# EAGLE design MCB-ODIN-W2-v2.0.0 (EAGLE 7.7.0)

## Sheet 1 of 2
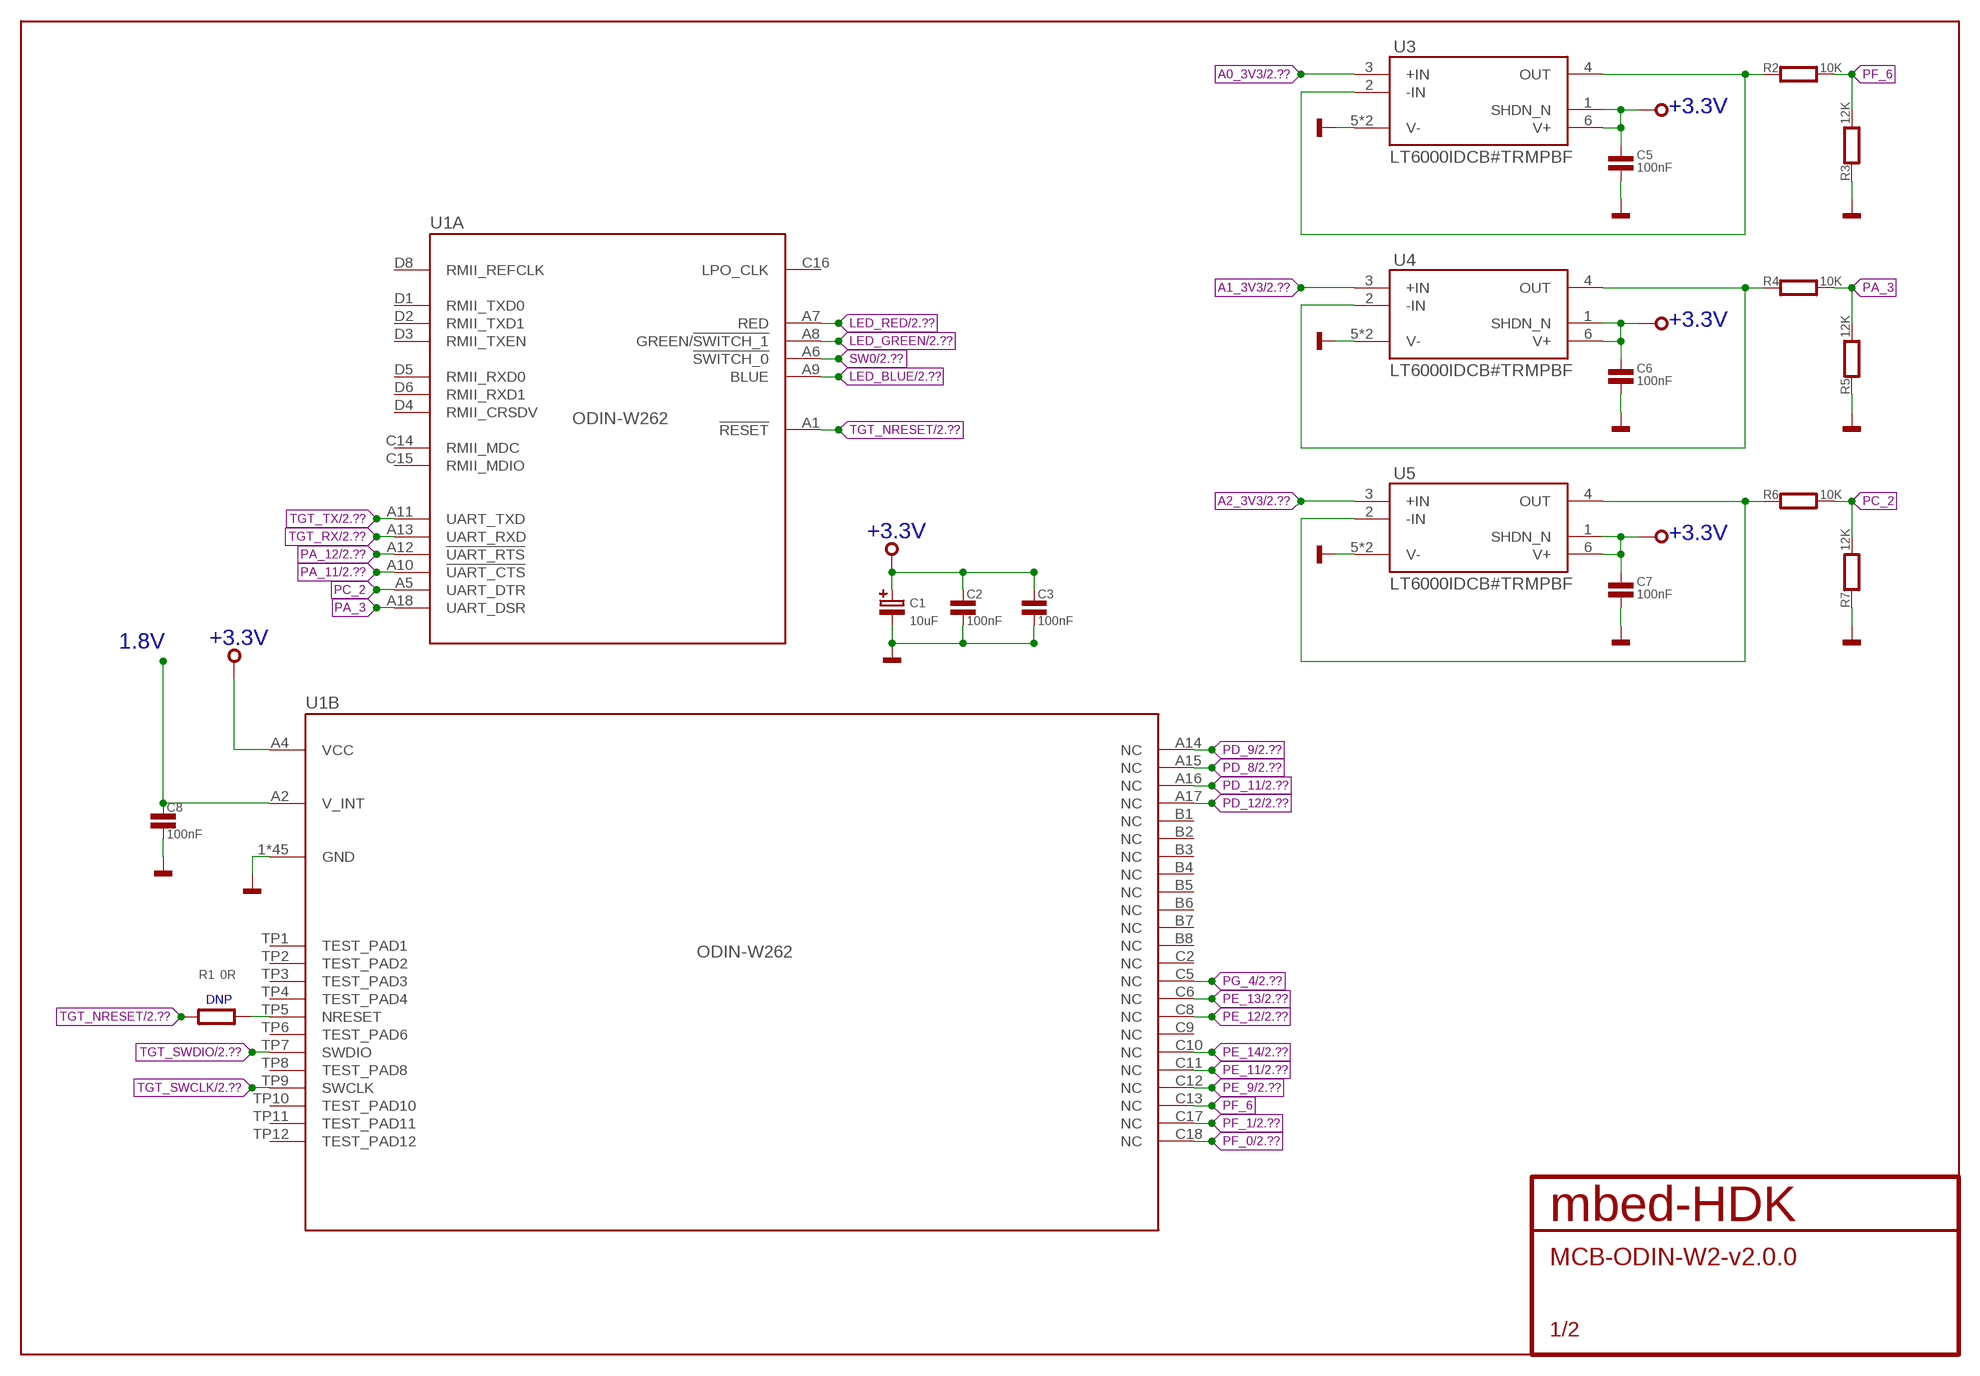
[diagram p0: schematic, sheet 1]

### Parts
C1  10uF  C-POLB  [SMC_B]
C2  100nF  C0603  [0603]
C3  100nF  C0603  [0603]
C5  100nF  C0603  [0603]
C6  100nF  C0603  [0603]
C7  100nF  C0603  [0603]
C8  100nF  C0603  [0603]
R1  0R  R0603  [0603]
R2  10K  R0603  [0603]
R3  12K  R0603  [0603]
R4  10K  R0603  [0603]
R5  12K  R0603  [0603]
R6  10K  R0603  [0603]
R7  12K  R0603  [0603]
U1  ODIN-W262  [ODIN-88]
U3  LT6000IDCB#TRMPBF  [6-DFN]
U4  LT6000IDCB#TRMPBF  [6-DFN]
U5  LT6000IDCB#TRMPBF  [6-DFN]

### Nets
1.8V: C8.1 U1.A2(B:V_INT) ; also sheet 2
+3.3V: C1.+ C2.1 C3.1 C5.1 C6.1 C7.1 U1.A4(B:VCC) U3.1(SHDN_N) U3.6(V+) U4.1(SHDN_N) U4.6(V+) U5.1(SHDN_N) U5.6(V+) ; also sheet 2
A0_3V3: U3.3(+IN) ; also sheet 2
A1_3V3: U4.3(+IN) ; also sheet 2
A2_3V3: U5.3(+IN) ; also sheet 2
GND: C1.- C2.2 C3.2 C5.2 C6.2 C7.2 C8.2 R3.1 R5.1 R7.1 U1.1(B:GND) U1.2(B:GND) U1.3(B:GND) U1.4(B:GND) U1.5(B:GND) U1.6(B:GND) U1.7(B:GND) U1.8(B:GND) U1.9(B:GND) U1.10(B:GND) U1.11(B:GND) U1.12(B:GND) U1.13(B:GND) U1.14(B:GND) U1.15(B:GND) U1.16(B:GND) U1.17(B:GND) U1.18(B:GND) U1.19(B:GND) U1.20(B:GND) U1.21(B:GND) U1.22(B:GND) U1.23(B:GND) U1.24(B:GND) U1.25(B:GND) U1.26(B:GND) U1.27(B:GND) U1.28(B:GND) U1.29(B:GND) U1.30(B:GND) U1.31(B:GND) U1.32(B:GND) U1.33(B:GND) U1.34(B:GND) U1.35(B:GND) U1.36(B:GND) U1.37(B:GND) U1.38(B:GND) U1.39(B:GND) U1.A3(B:GND) U1.C1(B:GND) U1.C3(B:GND) U1.C4(B:GND) U1.C7(B:GND) U1.D7(B:GND) U3.5(V-) U3.P$7(V-) U4.5(V-) U4.P$7(V-) U5.5(V-) U5.P$7(V-) ; also sheet 2
LED_BLUE: U1.A9(A:BLUE) ; also sheet 2
LED_GREEN: U1.A8(A:GREEN/!SWITCH_1) ; also sheet 2
LED_RED: U1.A7(A:RED) ; also sheet 2
N$1: R1.2 U1.TP5(B:NRESET)
N$2: R2.1 U3.2(-IN) U3.4(OUT)
N$3: R4.1 U4.2(-IN) U4.4(OUT)
N$4: R6.1 U5.2(-IN) U5.4(OUT)
PA_3: R4.2 R5.2 U1.A18(A:UART_DSR)
PA_11: U1.A10(A:!UART_CTS) ; also sheet 2
PA_12: U1.A12(A:!UART_RTS) ; also sheet 2
PC_2: R6.2 R7.2 U1.A5(A:UART_DTR)
PD_8: U1.A15(B:NC) ; also sheet 2
PD_9: U1.A14(B:NC) ; also sheet 2
PD_11: U1.A16(B:NC) ; also sheet 2
PD_12: U1.A17(B:NC) ; also sheet 2
PE_9: U1.C12(B:NC) ; also sheet 2
PE_11: U1.C11(B:NC) ; also sheet 2
PE_12: U1.C8(B:NC) ; also sheet 2
PE_13: U1.C6(B:NC) ; also sheet 2
PE_14: U1.C10(B:NC) ; also sheet 2
PF_0: U1.C18(B:NC) ; also sheet 2
PF_1: U1.C17(B:NC) ; also sheet 2
PF_6: R2.2 R3.2 U1.C13(B:NC)
PG_4: U1.C5(B:NC) ; also sheet 2
SW0: U1.A6(A:!SWITCH_0) ; also sheet 2
TGT_NRESET: R1.1 U1.A1(A:!RESET) ; also sheet 2
TGT_RX: U1.A13(A:UART_RXD) ; also sheet 2
TGT_SWCLK: U1.TP9(B:SWCLK) ; also sheet 2
TGT_SWDIO: U1.TP7(B:SWDIO) ; also sheet 2
TGT_TX: U1.A11(A:UART_TXD) ; also sheet 2
Unconnected: U1.B1(B:NC) U1.B2(B:NC) U1.B3(B:NC) U1.B4(B:NC) U1.B5(B:NC) U1.B6(B:NC) U1.B7(B:NC) U1.B8(B:NC) U1.C2(B:NC) U1.C9(B:NC) U1.C14(A:RMII_MDC) U1.C15(A:RMII_MDIO) U1.C16(A:LPO_CLK) U1.D1(A:RMII_TXD0) U1.D2(A:RMII_TXD1) U1.D3(A:RMII_TXEN) U1.D4(A:RMII_CRSDV) U1.D5(A:RMII_RXD0) U1.D6(A:RMII_RXD1) U1.D8(A:RMII_REFCLK) U1.TP1(B:TEST_PAD1) U1.TP2(B:TEST_PAD2) U1.TP3(B:TEST_PAD3) U1.TP4(B:TEST_PAD4) U1.TP6(B:TEST_PAD6) U1.TP8(B:TEST_PAD8) U1.TP10(B:TEST_PAD10) U1.TP11(B:TEST_PAD11) U1.TP12(B:TEST_PAD12)

### Notes on the sheet
- DNP

## Sheet 2 of 2
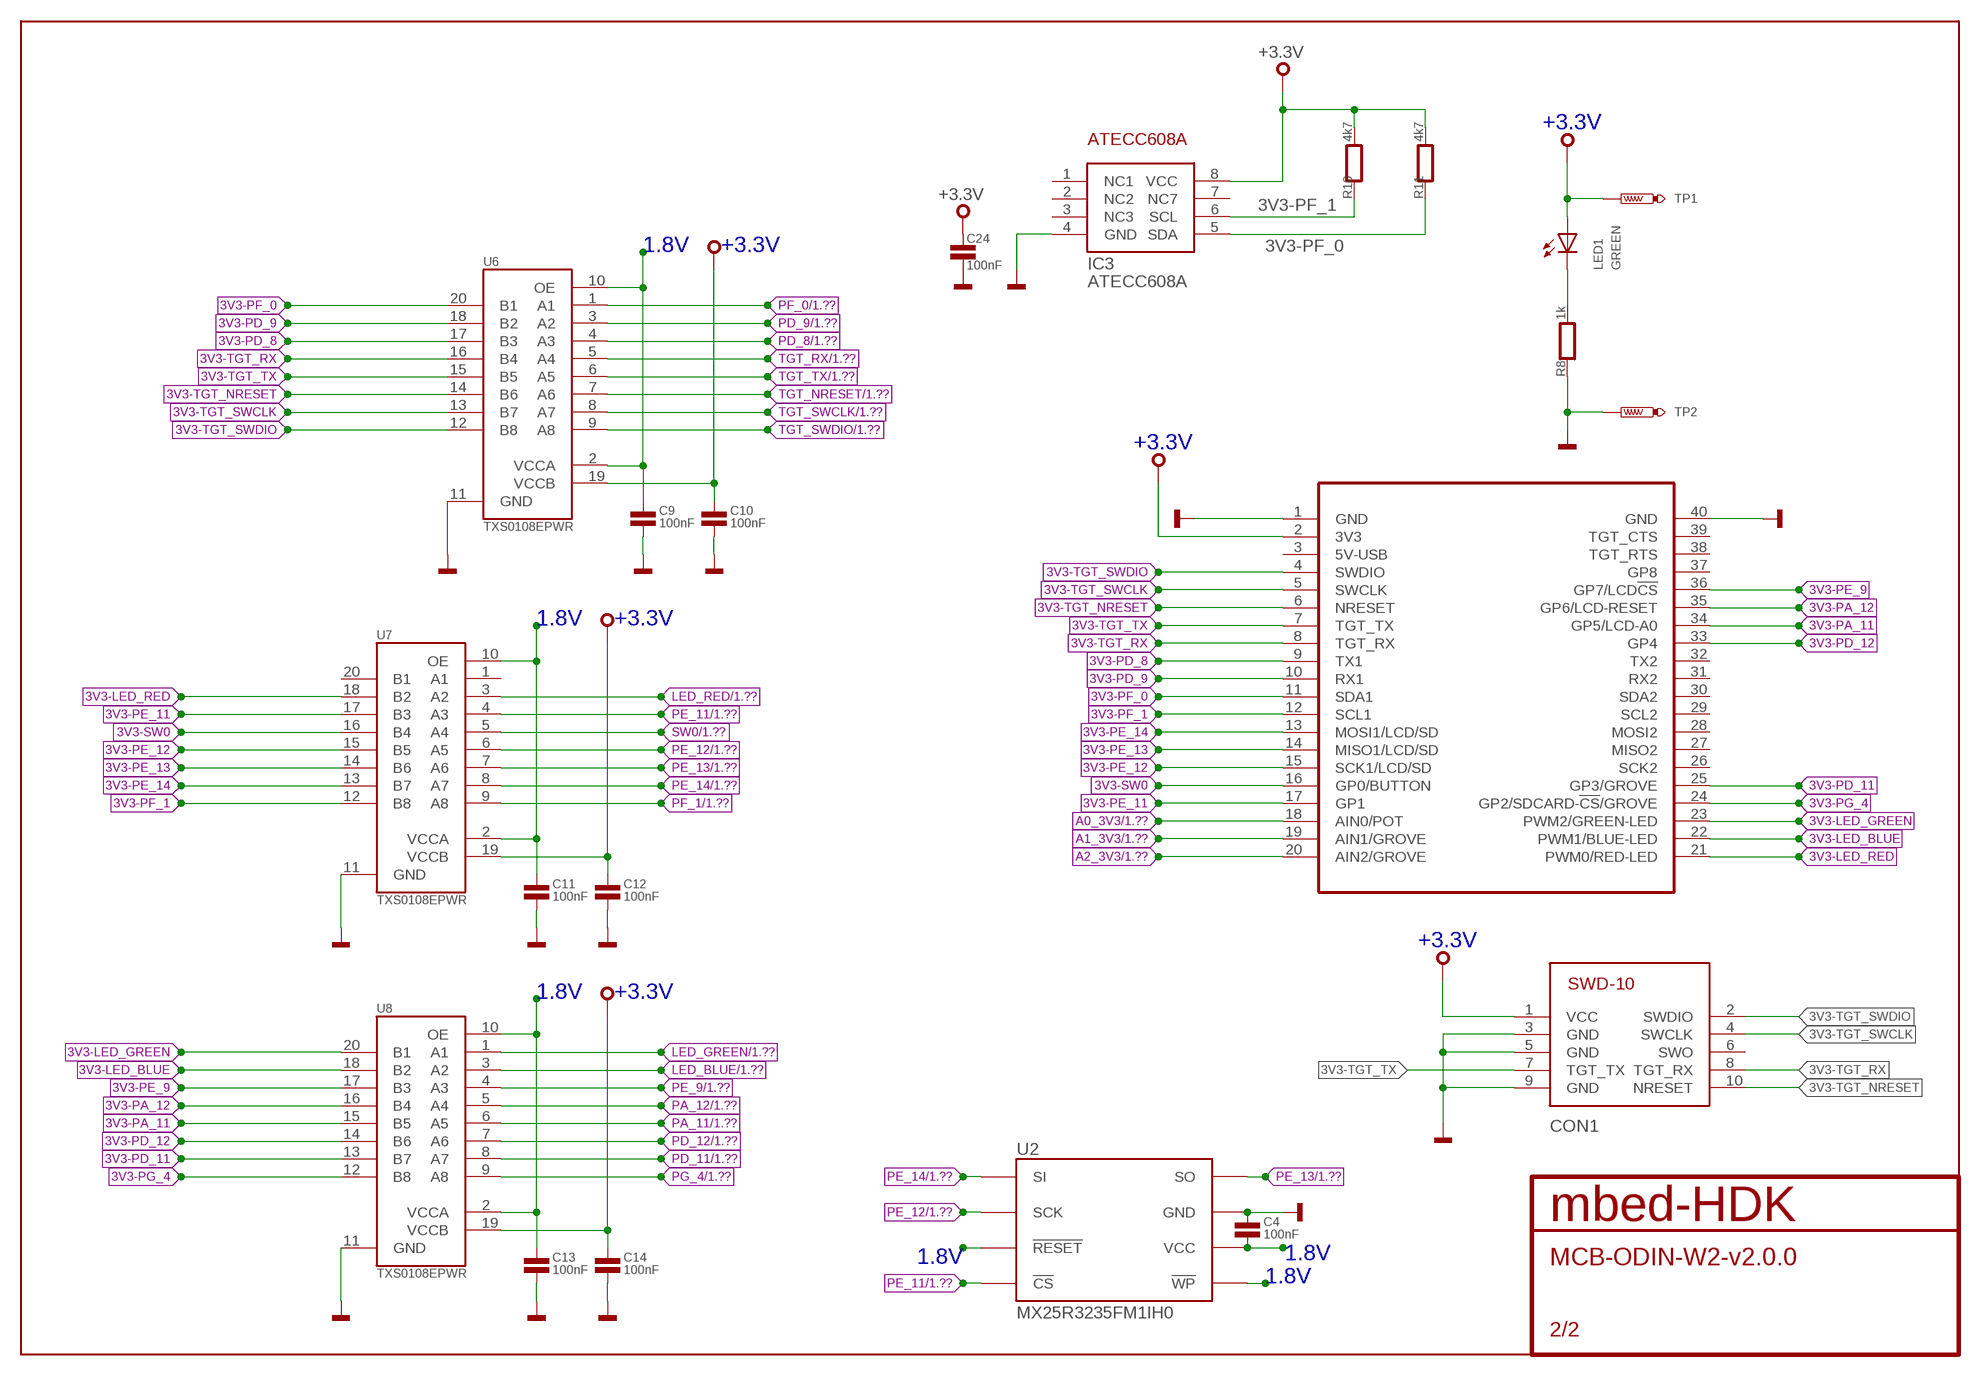
[diagram p1: schematic, sheet 2]

### Parts
C4  100nF  C0603  [0603]
C9  100nF  C0603  [0603]
C10  100nF  C0603  [0603]
C11  100nF  C0603  [0603]
C12  100nF  C0603  [0603]
C13  100nF  C0603  [0603]
C14  100nF  C0603  [0603]
C24  100nF  C0603  [0603]
CON1  SWD-10/TC2050_SMD  [FTSH-105-02]
IC3  ATECC608A  [SO8]
LED1  GREEN  SMD_LED0603  [CHIPLED_0603]
MOD1  MODULE_DAUGHTER  [MODULE_DAUGHTER]
R8  1k  R0603  [0603]
R10  4k7  R0603  [0603]
R11  4k7  R0603  [0603]
TP1  TEST_POINT-50R-PTH  [TP50-PTH]
TP2  TEST_POINT-50R-PTH  [TP50-PTH]
U2  MX25R3235FM1IH0  [SO8]
U6  TXS0108EPWR  [TSSOP-20]
U7  TXS0108EPWR  [TSSOP-20]
U8  TXS0108EPWR  [TSSOP-20]

### Nets
1.8V: C4.2 C9.1 C11.1 C13.1 U2.3(!WP) U2.7(!RESET) U2.8(VCC) U6.2(VCCA) U6.10(OE) U7.2(VCCA) U7.10(OE) U8.2(VCCA) U8.10(OE) ; also sheet 1
3V3-LED_BLUE: MOD1.22(PWM1/BLUE-LED) U8.18(B2)
3V3-LED_GREEN: MOD1.23(PWM2/GREEN-LED) U8.20(B1)
3V3-LED_RED: MOD1.21(PWM0/RED-LED) U7.18(B2)
3V3-PA_11: MOD1.34(GP5/LCD-A0) U8.15(B5)
3V3-PA_12: MOD1.35(GP6/LCD-RESET) U8.16(B4)
3V3-PD_8: MOD1.9(TX1) U6.17(B3)
3V3-PD_9: MOD1.10(RX1) U6.18(B2)
3V3-PD_11: MOD1.25(GP3/GROVE) U8.13(B7)
3V3-PD_12: MOD1.33(GP4) U8.14(B6)
3V3-PE_9: MOD1.36(GP7/LCD!CS) U8.17(B3)
3V3-PE_11: MOD1.17(GP1) U7.17(B3)
3V3-PE_12: MOD1.15(SCK1/LCD/SD) U7.15(B5)
3V3-PE_13: MOD1.14(MISO1/LCD/SD) U7.14(B6)
3V3-PE_14: MOD1.13(MOSI1/LCD/SD) U7.13(B7)
3V3-PF_0: IC3.5(SDA) MOD1.11(SDA1) R11.1 U6.20(B1)
3V3-PF_1: IC3.6(SCL) MOD1.12(SCL1) R10.1 U7.12(B8)
3V3-PG_4: MOD1.24(GP2/SDCARD-!CS!/GROVE) U8.12(B8)
3V3-SW0: MOD1.16(GP0/BUTTON) U7.16(B4)
3V3-TGT_NRESET: CON1.10(NRESET) MOD1.6(NRESET) U6.14(B6)
3V3-TGT_RX: CON1.8(TGT_RX) MOD1.8(TGT_RX) U6.16(B4)
3V3-TGT_SWCLK: CON1.4(SWCLK) MOD1.5(SWCLK) U6.13(B7)
3V3-TGT_SWDIO: CON1.2(SWDIO) MOD1.4(SWDIO) U6.12(B8)
3V3-TGT_TX: CON1.7(TGT_TX) MOD1.7(TGT_TX) U6.15(B5)
+3.3V: C10.1 C12.1 C14.1 C24.1 CON1.1(VCC) IC3.8(VCC) LED1.A MOD1.2(3V3) R10.2 R11.2 TP1.TP U6.19(VCCB) U7.19(VCCB) U8.19(VCCB) ; also sheet 1
A0_3V3: MOD1.18(AIN0/POT) ; also sheet 1
A1_3V3: MOD1.19(AIN1/GROVE) ; also sheet 1
A2_3V3: MOD1.20(AIN2/GROVE) ; also sheet 1
GND: C4.1 C9.2 C10.2 C11.2 C12.2 C13.2 C14.2 C24.2 CON1.3(GND) CON1.5(GND) CON1.9(GND) IC3.4(GND) MOD1.1(GND) MOD1.40(GND) R8.1 TP2.TP U2.4(GND) U6.11(GND) U7.11(GND) U8.11(GND) ; also sheet 1
LED_BLUE: U8.3(A2) ; also sheet 1
LED_GREEN: U8.1(A1) ; also sheet 1
LED_RED: U7.3(A2) ; also sheet 1
PA_1: LED1.C R8.2
PA_11: U8.6(A5) ; also sheet 1
PA_12: U8.5(A4) ; also sheet 1
PD_8: U6.4(A3) ; also sheet 1
PD_9: U6.3(A2) ; also sheet 1
PD_11: U8.8(A7) ; also sheet 1
PD_12: U8.7(A6) ; also sheet 1
PE_9: U8.4(A3) ; also sheet 1
PE_11: U2.1(!CS) U7.4(A3) ; also sheet 1
PE_12: U2.6(SCK) U7.6(A5) ; also sheet 1
PE_13: U2.2(SO) U7.7(A6) ; also sheet 1
PE_14: U2.5(SI) U7.8(A7) ; also sheet 1
PF_0: U6.1(A1) ; also sheet 1
PF_1: U7.9(A8) ; also sheet 1
PG_4: U8.9(A8) ; also sheet 1
SW0: U7.5(A4) ; also sheet 1
TGT_NRESET: U6.7(A6) ; also sheet 1
TGT_RX: U6.5(A4) ; also sheet 1
TGT_SWCLK: U6.8(A7) ; also sheet 1
TGT_SWDIO: U6.9(A8) ; also sheet 1
TGT_TX: U6.6(A5) ; also sheet 1
Unconnected: CON1.6(SWO) IC3.1(NC1) IC3.2(NC2) IC3.3(NC3) IC3.7(NC7) MOD1.3(5V-USB) MOD1.26(SCK2) MOD1.27(MISO2) MOD1.28(MOSI2) MOD1.29(SCL2) MOD1.30(SDA2) MOD1.31(RX2) MOD1.32(TX2) MOD1.37(GP8) MOD1.38(TGT_RTS) MOD1.39(TGT_CTS) U7.1(A1) U7.20(B1)

## Library data of the parts
C1 = mbed-HDK-RLC:C-POL: Polarised capacitor; MF: Kemet; MFN: T491B106K020AT; OC-DIGIKEY: 399-8298-1-ND; OC-MOUSER: 80-T491B106K020; OC-NEWARK: 57K1740
C2-C14 C24 = mbed-HDK-RLC:C: Capacitor
CON1 = mbed-HDK-Connector:SWD-10/TC2050: 1mm pitch 10-Pin Cortex Programming Header with optional TC2050 footprint solderless interchangeable
IC3 = mbed-HDK-MF-ATMEL:ATECC608A: I2C Secure element and crytpo accelerator; MF: Atmel; MFN: ATECC608A; OC-DIGIKEY: ATECC608A-SSHDA-TCT-ND; OC-MOUSER: 556-ATECC608ASSHDAB
LED1 = mbed-HDK-Optical:SMD_LED: LED SMD, Colour Red; MF: Wurth Electronics Inc; MFN: 150060RS75000; OC-DIGIKEY: 732-4978-1-ND; OC-MOUSER: 710-150060RS75000; OC-NEWARK: 2322071
MOD1 = mbed-HDK-misc-Board:MODULE_DAUGHTER
R1-R8 R10 R11 = mbed-HDK-RLC:R: Resistor
TP1 TP2 = mbed-HDK-Connector:TEST_POINT
U1 = mbed-HDK-MF-UBLOX:ODIN-W262: ODIN-W260: Host-based multiradio module with Wi-Fi and Bluetooth, internal antenna u-blox.com
U2 = mbed-HDK-IC:MX25R3235FM1IH0: Serial Flash 32 Mb 80 Mhz; MF: Macronix; MFN: MX25R3235FM2IH0; OC-DIGIKEY: 1092-1174-ND
U3-U5 = mbed-HDK-IC:LT6000IDCB#TRMPBF: IC OPAMP GBP 60KHZ RRO 6DFN; MF: Linear Technology; MFN: LT6000IDCB#TRMPBF; OC-DIGIKEY: LT6000IDCB#TRMPBFCT-ND; OC-NEWARK: 95M6567
U6-U8 = mbed-HDK-IC:TXS0108EPWR: 8-Bit Bi-directional, Level-Shifting, Voltage Translator; MF: Texas Instruments; MFN: TXS0108EPWR; OC-DIGIKEY: 296-23011-1-ND; OC-MOUSER: 595-TXS0108EPWR; OC-NEWARK: 05R8300

## Board
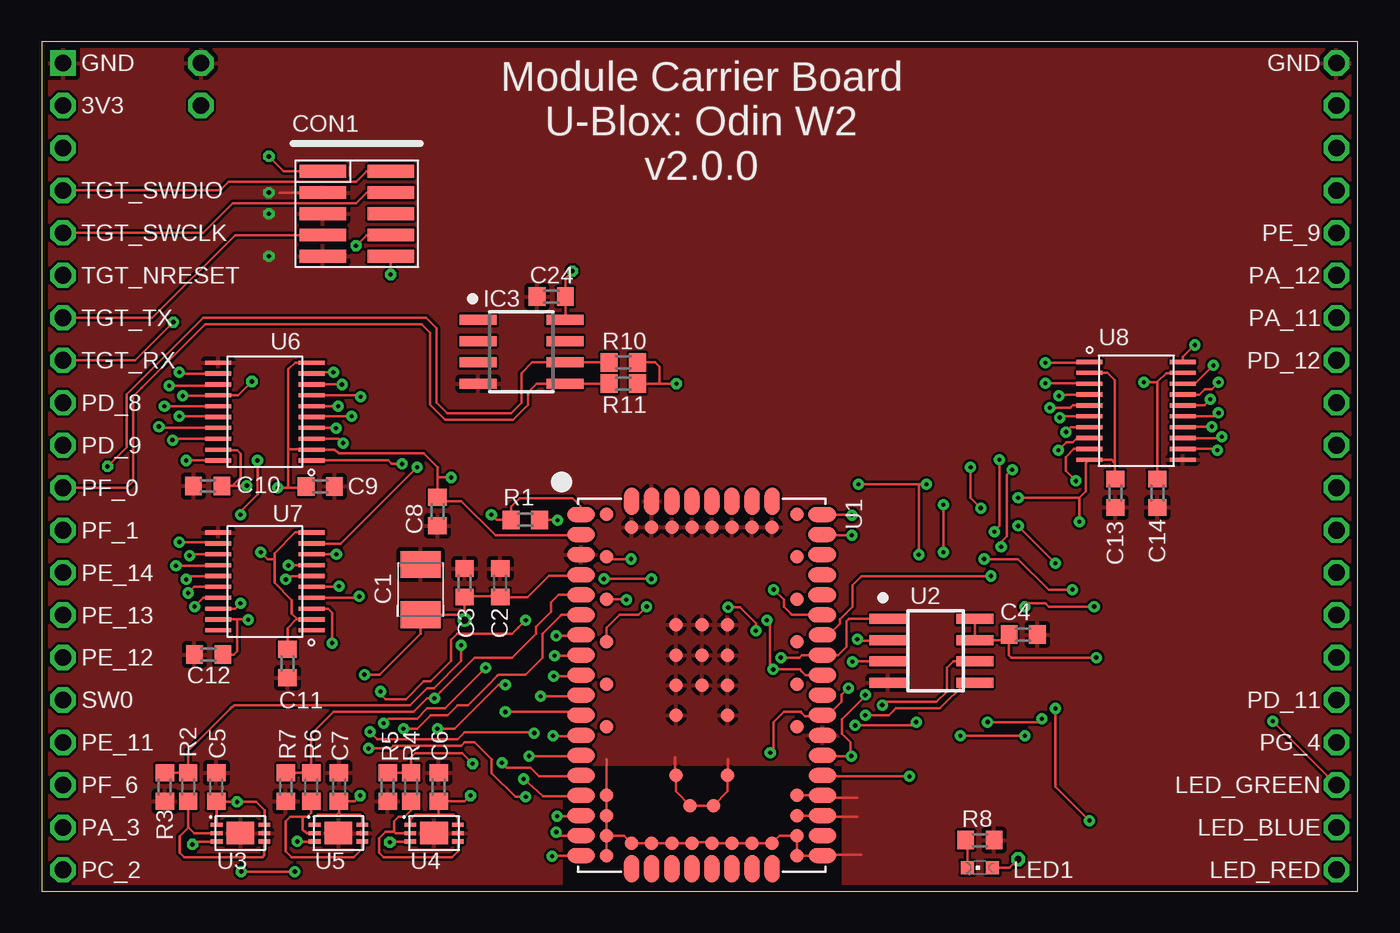
[diagram p2: board, top side]
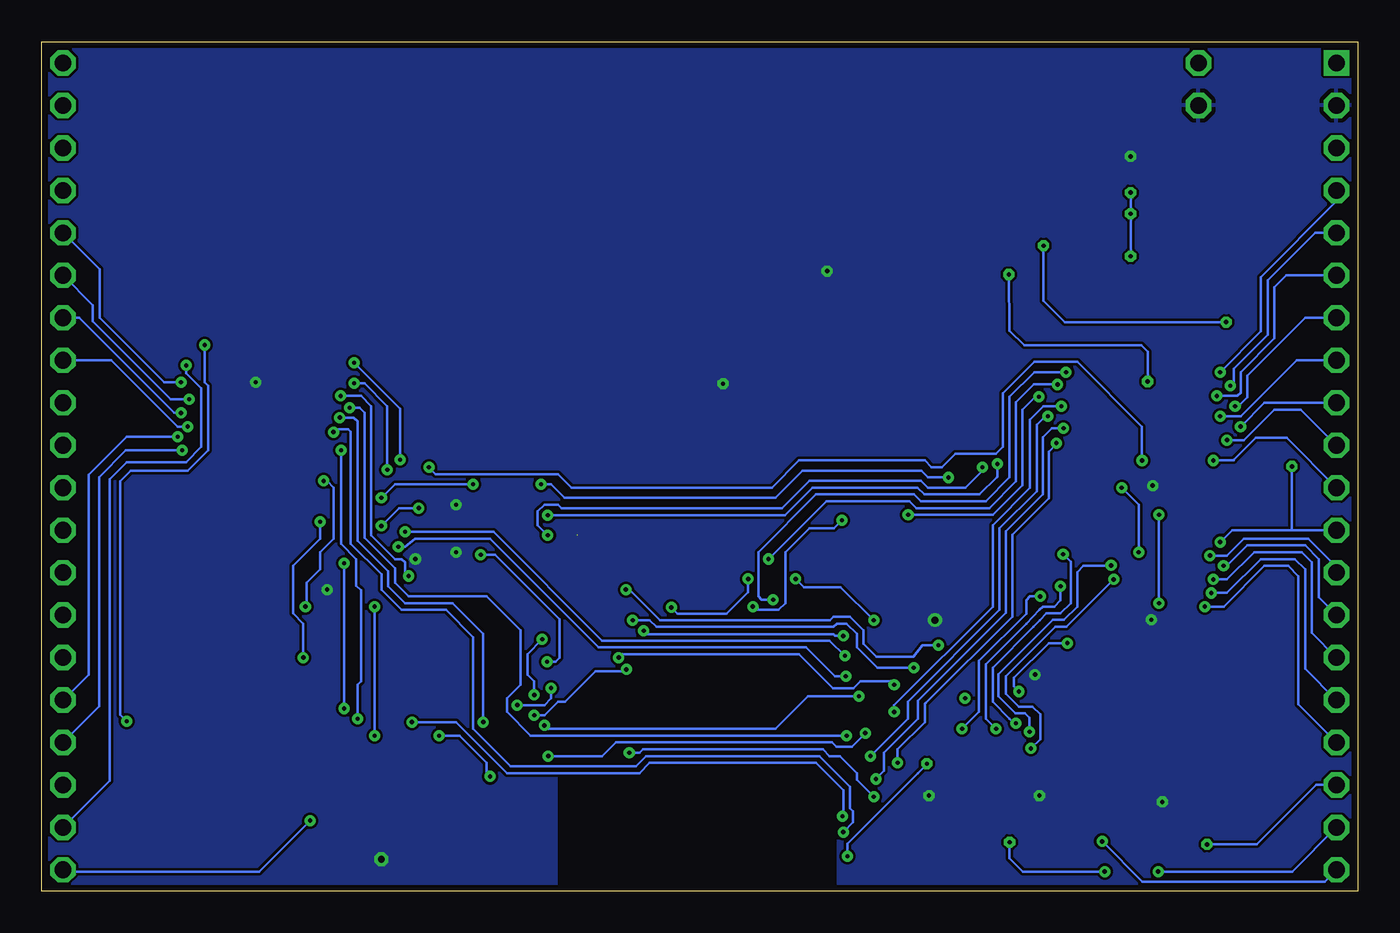
[diagram p3: board, bottom side, seen from below]

Size 78.74 x 50.8 mm. Coordinates in mm from the lower left corner, seen from the top.
Copper layers ((1*16)): Top 0.035mm / dielectric 0.8mm / Bottom 0.035mm
Design rules "mbed-HDK-6-6-2-layer": minimum track width 6mil, minimum drill 9mil, track to track 6mil, track to pad 6mil, pad to pad 6mil, via to via 6mil, smd to smd 6mil, copper to edge 15mil, drill to drill 8mil, minimum pad ring 10mil, minimum via ring 8mil, stop-mask expansion 4mil, vias tented up to drill 0mil, thermal gap 10mil
tRestrict: area 31.2,0.2 to 47.9,7.5
bRestrict: area 31.2,0.2 to 47.9,7.5

### Footprints (pad centres in the part's own frame; a part is rotated, then mirrored left to right if it is on the bottom)
SMC_B = smd 1.6 x 2.4: + -1.5,0; - 1.5,0
0603 = smd 1 x 1.1: 1 -0.85,0; 2 0.85,0
FTSH-105-02 = smd 0.762 x 2.794: 1 0.381,-2.032; 2 0.381,2.032; 3 1.651,-2.032; 4 1.651,2.032; 5 2.921,-2.032; 6 2.921,2.032; 7 4.191,-2.032; 8 4.191,2.032; 9 5.461,-2.032; 10 5.461,2.032
SO8 = smd 0.6 x 2.2: 1 -1.905,-2.6; 2 -0.635,-2.6; 3 0.635,-2.6; 4 1.905,-2.6; 5 1.905,2.6; 6 0.635,2.6; 7 -0.635,2.6; 8 -1.905,2.6
CHIPLED_0603 = smd 0.8 x 0.8: A 0,-0.75; C 0,0.75
MODULE_DAUGHTER = drill 1 square: 1 0,0 | drill 1 octagon: 2 0,-2.54; 3 0,-5.08; 4 0,-7.62; 5 0,-10.16; 6 0,-12.7; 7 0,-15.24; 8 0,-17.78; 9 0,-20.32; 10 0,-22.86; 11 0,-25.4; 12 0,-27.94; 13 0,-30.48; 14 0,-33.02; 15 0,-35.56; 16 0,-38.1; 17 0,-40.64; 18 0,-43.18; 19 0,-45.72; 20 0,-48.26; 21 76.2,-48.26; 22 76.2,-45.72; 23 76.2,-43.18; 24 76.2,-40.64; 25 76.2,-38.1; 26 76.2,-35.56; 27 76.2,-33.02; 28 76.2,-30.48; 29 76.2,-27.94; 30 76.2,-25.4; 31 76.2,-22.86; 32 76.2,-20.32; 33 76.2,-17.78; 34 76.2,-15.24; 35 76.2,-12.7; 36 76.2,-10.16; 37 76.2,-7.62; 38 76.2,-5.08; 39 76.2,-2.54; 40 76.2,0
TP50-PTH = drill 1 octagon: TP 0,0
ODIN-88 = smd 0.8 x 0.8: 1 6.6,-5.7; 2 7.8,-5.7; 3 9,-5.7; 4 10.2,-5.7; 5 9.45,-4.2; 6 9.45,-3; 7 9.45,-1.8; 8 9.45,-0.6; 9 9.45,0.6; 10 9.45,1.8; 11 9.45,3; 12 9.45,4.2; 13 10.2,5.7; 14 9,5.7; 15 7.8,5.7; 16 6.6,5.7; 17 -9.45,4.2; 18 -9.45,3; 19 -9.45,1.8; 20 -9.45,0.6; 21 -9.45,-0.6; 22 -9.45,-1.8; 23 -9.45,-3; 24 -9.45,-4.2; 25 -3.6,-1.54; 26 -1.8,-1.54; 27 0,-1.54; 28 1.8,-1.54; 29 5.4,-1.54; 30 7.2,-0.7; 31 -3.6,0; 32 -1.8,0; 33 0,0; 34 -3.6,1.54; 35 -1.8,1.54; 36 0,1.54; 37 1.8,1.54; 38 5.4,1.54; 39 7.2,0.7; TP1 2.49,-5.7; TP2 2.49,5.7; TP3 -0.05,-5.7; TP4 -0.05,5.7; TP5 -2.59,-5.7; TP6 -2.59,5.7; TP7 -5.13,-5.7; TP8 -5.13,5.7; TP9 -7.67,-5.7; TP10 -7.67,5.7; TP11 -10.21,-5.7; TP12 -10.21,5.7 | smd 0.9 x 1.651: A1 -10.196,-7.225; A2 -9.002,-7.225; A3 -7.809,-7.225; A4 -6.589,-7.225; A5 -5.396,-7.225; A6 -4.202,-7.225; A7 -3,-7.225; A8 -1.8,-7.225; A9 -0.6,-7.225; A10 0.6,-7.225; A11 1.8,-7.225; A12 3,-7.225; A13 4.2,-7.225; A14 5.4,-7.225; A15 6.6,-7.225; A16 7.8,-7.225; A17 9.006,-7.225; A18 10.2,-7.225; C1 10.2,7.225; C2 9,7.225; C3 7.8,7.225; C4 6.6,7.225; C5 5.4,7.225; C6 4.2,7.225; C7 3,7.225; C8 1.8,7.225; C9 0.6,7.225; C10 -0.6,7.225; C11 -1.8,7.225; C12 -3,7.225; C13 -4.2,7.2; C14 -5.4,7.2; C15 -6.6,7.2; C16 -7.8,7.2; C17 -9,7.2; C18 -10.2,7.2 | smd 1.651 x 0.9: B1 10.984,-4.202; B2 10.984,-3; B3 10.984,-1.8; B4 10.984,-0.6; B5 10.984,0.6; B6 10.984,1.794; B7 10.984,3; B8 10.984,4.2; D1 -10.987,4.2; D2 -10.987,3; D3 -10.987,1.8; D4 -10.987,0.6; D5 -10.987,-0.6; D6 -10.987,-1.8; D7 -10.987,-3; D8 -10.987,-4.2
6-DFN = smd 0.7 x 0.25: 1 0,0; 2 0,-0.5; 3 0,-1; 4 2.85,-1; 5 2.85,-0.5; 6 2.85,0 | smd 1.65 x 1.35: P$7 1.425,-0.5
TSSOP-20 = smd 1.55 x 0.25: 1 0,0; 2 0,-0.65; 3 0,-1.3; 4 0,-1.95; 5 0,-2.6; 6 0,-3.25; 7 0,-3.9; 8 0,-4.55; 9 0,-5.2; 10 0,-5.85; 11 5.6,-5.85; 12 5.6,-5.2; 13 5.6,-4.55; 14 5.6,-3.9; 15 5.6,-3.25; 16 5.6,-2.6; 17 5.6,-1.95; 18 5.6,-1.3; 19 5.6,-0.65; 20 5.6,0

### Placement (x,y rotation side)
C1  22.66,18.03 90 top
C2  27.43,18.44 90 top
C3  25.3,18.44 90 top
C4  58.72,15.34 180 top
C5  10.44,6.22 90 top
C6  23.75,6.22 90 top
C7  17.78,6.22 90 top
C8  23.67,22.71 270 top
C9  16.66,24.21 0 top
C10  9.93,24.23 180 top
C11  14.71,13.61 270 top
C12  9.98,14.15 180 top
C13  64.24,23.8 270 top
C14  66.75,23.8 270 top
C24  30.48,35.56 180 top
CON1  18.85,43.43 270 top
IC3  28.7,32.26 270 top
LED1  56.13,1.4 90 top
MOD1  1.27,49.53 0 top
R1  28.93,22.2 0 top
R2  8.76,6.22 90 top
R3  7.37,6.22 90 top
R4  22.1,6.22 90 top
R5  20.7,6.22 90 top
R6  16.13,6.22 90 top
R7  14.61,6.22 90 top
R8  56.13,3.05 180 top
R10  34.8,31.62 0 top
R11  34.8,30.35 0 top
TP1  9.52,46.99 180 top
TP2  9.52,49.53 180 top
U1  39.5,12.32 270 top
U2  53.24,14.38 270 top
U3  10.46,3.96 0 top
U4  22.05,3.96 0 top
U5  16.33,3.96 0 top
U6  16.15,25.76 180 top
U7  16.15,15.6 180 top
U8  62.69,31.65 0 top

### Tracks (layer width: path | path; a pad name or v marks a point on that pad's centre or on a via)
1.8V  (via drill 0.25)
  Top 0.152: U6.10 15.15,31.61 14.78,31.24 14.73,31.19 14.73,26.42 | U7.2 15.3,16.25 | 15.3,16.25 14.96,16.59 14.96,17.4 13.92,18.44 13.92,19.86 | 13.92,19.86 13.92,20.22 15.16,21.46 16.17,21.46 | 16.36,21.46 16.17,21.46 | 16.17,21.46 U7.10 | 15.3,16.25 15.23,16.25 14.71,15.72 C11.1 | C13.1 64.21,24.67 64.21,25.6 | 64.21,25.6 64.02,25.8 U8.10 62.48,25.59 62.48,23.93 62.08,23.52 | U8.2 62.7,31.01 63.75,31.01 64.21,30.56 64.21,25.6 | v13.11,20.27 13.51,19.86 13.92,19.86 | v62.08,22.1 62.08,23.52 | 23.67,24.74 C8.1 23.91,23.32 25.1,23.32 27.14,21.27 32.22,21.27 U1.A2 | 23.67,24.74 23.67,25.35 22.83,26.19 17.75,26.19 17.54,26.41 U6.2 16.14,26.39 arc90 16.11,26.42 14.96,26.42 14.73,26.42 | 23.67,24.74 v24.49,24.74 | v48.87,24.33 52.53,24.33 | 52.53,24.33 v52.93,24.33 | v58.42,23.52 62.08,23.52 | 57.55,15.01 arc90 C4.2 | U2.8 U2.7 57.55,15.01 | 57.55,15.01 C4.2 | C4.2 57.88,14.11 58.01,13.97 v63.09,13.97 | U2.3 48.67,13.74 v48.51,13.72 | v52.48,20.12 52.48,24.28 52.53,24.33 | v14.12,24.13 14.73,24.13 | 14.73,24.13 15.74,24.13 arc90 C9.1 | 14.73,24.13 14.73,24.74 14.73,26.37 14.73,26.42
  Bottom 0.152: v14.12,24.13 13.11,23.11 v13.11,20.27 | v24.49,24.74 25.71,24.74 26.11,25.15 33.22,25.15 34.85,23.52 47.45,23.52 48.26,24.33 v48.87,24.33 | v52.93,24.33 57.61,24.33 v58.42,23.52 | v63.09,13.97 63.09,16 63.7,16.61 63.7,19.46 62.08,21.08 v62.08,22.1 | v48.51,13.72 48.01,13.72 47.75,13.97 47.75,16.26 51.61,20.12 v52.48,20.12
3V3-LED_BLUE  (via drill 0.25)
  Top 0.152: U8.18 69.01,30.35 v70.1,31.45
  Bottom 0.152: v70.1,31.45 70.1,30.99 69.19,30.07 69.19,26.57 70.1,25.65 73.66,25.65 74.68,24.64 74.68,6.6 MOD1.22
3V3-LED_GREEN  (via drill 0.25)
  Top 0.152: U8.20 68.29,31.96 v68.99,32.66 | v73.66,10.16 MOD1.23
  Bottom 0.152: v68.99,32.66 68.99,30.43 68.78,30.23 68.78,26.37 70,25.15 73.41,25.15 74.04,24.51 74.04,10.54 v73.66,10.16
3V3-LED_RED  (via drill 0.25)
  Top 0.152: U7.18 11.56,16.9 v11.89,17.22 | v11.89,22.5 11.89,22.71 12.9,23.72 v12.9,25.76 | v55.58,25.35 55.58,23.52 v56.19,22.91 | v58.42,21.84 v60.66,19.61 | v62.69,4.22 60.66,6.25 v60.66,10.92
  Bottom 0.152: v11.89,17.22 v11.89,22.5 | v12.9,25.76 12.9,27.79 16.76,31.65 19.36,31.65 21.23,29.77 21.23,26.57 21.64,26.16 24.08,26.16 24.89,25.35 25.5,25.35 25.91,25.76 33.43,25.76 35.05,24.13 47.04,24.13 47.85,24.94 55.17,24.94 v55.58,25.35 | v56.19,22.91 57.35,22.91 v58.42,21.84 | v62.69,4.22 65.73,1.17 77.37,1.17 MOD1.21 | v60.66,19.61 v60.66,10.92
3V3-PA_11  (via drill 0.25)
  Top 0.152: v70.41,28.6 70.21,28.4 U8.15
  Bottom 0.152: v70.41,28.6 70.81,28.6 76.5,34.29 MOD1.34
3V3-PA_12  (via drill 0.25)
  Top 0.152: v69.93,29.41 69.56,29.05 U8.16
  Bottom 0.152: v69.93,29.41 71.02,29.41 75.69,34.09 75.69,35.05 MOD1.35
3V3-PD_8  (via drill 0.25)
  Top 0.152: v7.01,27.79 7.09,27.71 U6.17
  Bottom 0.152: v7.01,27.79 5.59,29.21 MOD1.9
3V3-PD_9  (via drill 0.25)
  Top 0.152: v7.82,26.98 7.9,27.06 U6.18
  Bottom 0.152: v7.82,26.98 6.81,26.98 4.98,28.8 3.4,28.8 MOD1.10
3V3-PD_11  (via drill 0.25)
  Top 0.152: v70.61,27.18 70.53,27.1 U8.13
  Bottom 0.152: v70.61,27.18 73.66,27.18 75.95,24.89 75.95,12.95 MOD1.25
3V3-PD_12  (via drill 0.25)
  Top 0.152: v70,27.79 68.33,27.79 U8.14
  Bottom 0.152: v70,27.79 70.61,27.79 74.57,31.75 MOD1.33
3V3-PE_9  (via drill 0.25)
  Top 0.152: v70.41,30.43 70,30.02 69.6,30.02 69.27,29.7 U8.17
  Bottom 0.152: v70.41,30.43 71.42,30.43 75.29,34.29 75.29,37.19 MOD1.36
3V3-PE_11  (via drill 0.25)
  Top 0.152: v9.14,17.02 9.67,17.55 U7.17
  Bottom 0.152: v9.14,17.02 8.03,17.02 5.59,19.46 4.17,19.46 3.56,18.85 3.56,11.18 MOD1.17
3V3-PE_12  (via drill 0.25)
  Top 0.152: v8.64,18.64 8.84,18.85 U7.15
  Bottom 0.152: v8.64,18.64 7.82,18.64 6.2,20.27 3.35,20.27 2.74,19.66 2.74,15.44 MOD1.15
3V3-PE_13  (via drill 0.25)
  Top 0.152: v8.03,19.46 10.55,19.46 U7.14
  Bottom 0.152: v8.03,19.46 7.82,19.46 6.6,20.68 3.15,20.68 2.34,19.86 2.34,17.58 MOD1.14
3V3-PE_14  (via drill 0.25)
  Top 0.152: v8.84,20.07 8.92,20.15 U7.13
  Bottom 0.152: v8.84,20.07 7.82,20.07 6.81,21.08 2.95,21.08 1.27,19.41 MOD1.13
3V3-PF_0  (via drill 0.25)
  Top 0.152: v8.64,25.76 U6.20 | R11.1 IC3.5 29.59,30.35 29.08,29.84 29.08,29.08 28.19,28.19 24.13,28.19 23.24,29.08 23.24,33.4 22.73,33.91 17.91,33.91 9.78,33.91 5.97,30.1 5.46,29.59 5.46,24.51 5.08,24.13 MOD1.11
  Bottom 0.152: v8.64,25.76 7.42,25.76 7.42,25.79 6.1,27.12 4.25,27.12 MOD1.11
3V3-PF_1  (via drill 0.25)
  Top 0.152: v8.23,20.88 10.47,20.88 U7.12 | R10.1 IC3.6 29.34,31.62 28.7,30.99 28.7,29.21 28.07,28.57 24.26,28.57 23.62,29.21 23.62,33.66 22.99,34.29 9.65,34.29 5.97,30.61 5.08,29.72 5.08,26.54 v3.94,25.4
  Bottom 0.152: 3.94,21.59 7.52,21.59 v8.23,20.88 | v3.94,25.4 3.94,21.59 | 3.94,21.59 MOD1.12
3V3-PG_4  (via drill 0.25)
  Top 0.152: v70.33,26.37 70.25,26.45 U8.12
  Bottom 0.152: v70.33,26.37 73.71,26.37 75.31,24.76 75.31,11.05 MOD1.24
3V3-SW0  (via drill 0.25)
  Top 0.152: v8.76,17.83 9.13,18.2 U7.16
  Bottom 0.152: v8.76,17.83 7.82,17.83 5.79,19.86 3.76,19.86 3.15,19.25 3.15,13.31 MOD1.16
3V3-TGT_NRESET  (via drill 0.25)
  Top 0.152: v8.43,29.62 10.52,29.62 U6.14 11.75,29.66 v12.57,30.48 | v20.88,36.88 CON1.10
  Bottom 0.152: v8.43,29.62 7.21,29.62 7.01,29.82 7.01,31.04 4.98,33.07 4.98,36.12 4.27,36.83 MOD1.6 | v12.57,30.48 12.57,32.26 12.95,32.64 19.94,32.64 20.83,33.53 v20.88,36.88
3V3-TGT_RX  (via drill 0.25)
  Top 0.152: v8.23,28.4 10.51,28.4 U6.16 | CON1.8 19.43,39.24 v18.8,38.61 | v7.87,34.04 5.59,31.75 MOD1.8
  Bottom 0.152: v8.23,28.4 7.01,28.4 3.66,31.75 MOD1.8 | v18.8,38.61 18.8,35.31 17.53,34.04 v7.87,34.04
3V3-TGT_SWCLK  (via drill 0.25)
  Top 0.152: v7.62,30.23 10.55,30.23 U6.13 | CON1.4 19.43,41.78 18.8,41.15 11.43,41.15 9.65,39.37 MOD1.5
  Bottom 0.152: v7.62,30.23 7.42,30.43 7.42,31.24 5.38,33.27 5.38,36.52 2.54,39.37 MOD1.5
3V3-TGT_SWDIO  (via drill 0.25)
  Top 0.152: v8.23,31.04 8.31,30.96 U6.12 | CON1.2 19.43,43.05 18.8,42.42 11.18,42.42 10.67,41.91 MOD1.4
  Bottom 0.152: v8.23,31.04 5.79,33.48 5.79,36.73 1.27,41.25 MOD1.4
3V3-TGT_TX  (via drill 0.25)
  Top 0.152: v7.34,29.01 U6.15 | CON1.7 11.56,39.24 6.6,34.29 MOD1.7
  Bottom 0.152: v7.34,29.01 7.14,29.01 6.6,29.54 6.6,30.84 3.15,34.29 MOD1.7
+3.3V  (via drill 0.25, 0.41)
  Top 0.152: 18.05,5.57 C7.1 | v56.39,19.86 58.42,19.86 60.25,18.03 v61.67,18.03 | v53.95,23.11 v53.95,20.27 | U6.19 10.59,26.37 11.68,26.37 11.89,26.16 11.89,24.74 11.38,24.23 C10.1 12.24,24.23 v12.27,24.26 | U7.19 11.64,16.25 | 11.64,16.25 12.33,16.25 v12.34,16.23 | U8.19 68.28,30.99 67.28,30.99 66.75,30.45 66.75,30.43 | C14.1 66.75,30.43 | 66.75,30.43 v65.94,30.43 | 25.3,17.63 27.39,17.63 C2.1 29.06,17.59 30.34,18.87 32.24,18.87 U1.A4 | 25.3,17.63 25.1,17.63 25.13,17.59 C3.1 | C1.+ 24.24,16.53 24.97,16.53 v25.3,16.2 25.3,17.63 | C1.+ 24.2,16.53 | v19.3,12.95 20.22,12.95 22.66,15.39 C1.+ | CON1.1 14.48,43.05 v13.59,43.94 | LED1.A 57.91,1.4 v58.42,1.9 | v31.75,37.08 31.33,36.66 C24.1 31.33,34.19 IC3.8 | R11.2 36.96,30.35 | 36.96,30.35 v37.97,30.35 | R10.2 36.7,31.62 36.96,31.37 36.96,30.35 | U3.1 10.46,5.35 | 10.46,5.35 C5.1 | 10.46,5.35 11.32,5.35 v11.68,5.33 12.83,5.33 13.33,4.83 13.33,3.98 U3.6 | U5.1 16.33,4.39 16.51,4.57 17.65,4.57 17.78,4.7 | U5.6 19.18,4.44 19.05,4.57 17.91,4.57 17.78,4.7 | v19.05,5.71 18.71,5.37 C7.1 | C7.1 17.78,4.7 | U4.1 22.05,4.27 22.35,4.57 23.75,4.57 | 23.75,4.57 24.64,4.57 24.9,4.31 U4.6 | v25.65,5.71 25.31,5.37 C6.1 23.75,4.57 | C12.1 11.48,14.15 11.68,14.35 11.68,16.2 11.64,16.25
  Bottom 0.152: v12.27,24.26 12.34,24.26 | v12.34,16.23 12.34,16.31 12.45,16.41 | v65.94,30.43 65.73,30.43
  pour Bottom: 0,0 78.49,0 78.49,50.8 0,50.8
A0_3V3  (via drill 0.25)
  Top 0.152: U3.3 9.18,2.96 v9.02,2.79
  Bottom 0.152: MOD1.18 2.48,6.35 6.03,2.79 v9.02,2.79
A1_3V3  (via drill 0.25)
  Top 0.152: U4.3 22.01,2.96 21,2.96 20.87,2.96 v20.83,2.92 | v15.14,1.17 v11.94,1.17
  Bottom 0.152: v15.14,1.17 20.04,1.17 20.83,1.96 v20.83,2.92 | v11.94,1.17 3.91,1.17 MOD1.19
A2_3V3  (via drill 0.25)
  Top 0.152: U5.3 15.05,2.96 v15.29,2.97
  Bottom 0.152: v15.29,2.97 12.88,0.56 1.98,0.56 MOD1.20
GND  (via drill 0.25)
  Top 0.152: 41.07,6.86 41.07,6.92 | 41.07,6.92 41.07,7.87 | CON1.3 14.22,41.78 | U1.29 37.96,5.96 U1.30 U1.39 41.04,5.96 U1.38 41.07,6.92 | 49.02,2.16 46.76,2.16 U1.C1 U1.13 U1.14 44.15,3.32 U1.12 U1.11 U1.10 U1.9 40.05,2.92 38.86,2.92 | 48.77,4.44 46.8,4.44 U1.C3 U1.15 | 48.77,5.59 46.85,5.59 U1.C4 U1.16 | 33.78,7.87 33.78,5.73 U1.1 U1.2 U1.3 | U1.4 U1.3 | U1.3 34.85,3.32 U1.5 U1.6 U1.7 U1.8 | 37.9,6.98 37.9,8
  Bottom 0.152: v13.59,41.78 v13.59,40.51 v13.59,37.97
  pour Top: 0,0 78.74,0 78.74,50.8 0,50.8
LED_BLUE  (via drill 0.25)
  Top 0.152: 30.65,12.87 v30.63,12.85 32.2,12.85 U1.A9 | v57.4,20.6 57.4,20.88 57.76,21.23 57.76,24.89 v58.06,25.2 | v60.05,30.38 62.66,30.38 U8.3
  Bottom 0.152: v30.63,12.85 31.29,12.85 33.02,14.58 45.41,14.58 51.92,21.08 56.39,21.08 57,20.6 v57.4,20.6 | v58.06,25.2 58.06,29.01 59.44,30.38 v60.05,30.38
LED_GREEN  (via drill 0.25)
  Top 0.152: v30.68,14.07 32.22,14.07 U1.A8 | v57,21.49 57,21.54 57.3,21.84 v57.3,25.81 | v60.05,31.6 62.64,31.6 U8.1
  Bottom 0.152: 30.58,14.02 30.63,14.07 v30.68,14.07 31.6,14.99 45.21,14.99 51.71,21.49 v57,21.49 | v57.3,25.81 57.3,28.85 v60.05,31.6
LED_RED  (via drill 0.25)
  Top 0.152: U7.3 17.14,16.9 17.37,16.66 v17.37,14.83 | v20.27,11.94 20.27,11.79 20.57,11.48 21.79,11.48 22.86,12.55 23.27,12.55 24.49,13.77 24.49,15.04 24.84,15.39 25.45,15.39 28.14,15.39 28.5,15.75 v28.96,16.2 | v42.72,15.57 42.72,16.03 41.78,16.97 v41.07,16.97 | v33.63,18.67 v36.47,18.67 | U1.A7 32.22,15.26 v30.79,15.26
  Bottom 0.152: v20.27,11.94 20.57,12.24 20.57,12.75 18.49,14.83 v17.37,14.83 | v42.72,15.57 42.52,15.37 31.37,15.37 31.27,15.26 v30.79,15.26 | v28.96,16.2 30.94,18.19 33.15,18.19 v33.63,18.67 | v36.47,18.67 36.47,17.88 37.77,16.59 40.69,16.59 v41.07,16.97
N$1  (via drill 0.25)
  Top 0.152: v36.19,17.02 35.71,16.54 34.57,16.54 33.78,15.75 33.8,15.73 U1.TP5 | R1.2 30.84,22.2 v30.86,22.17
  Bottom 0.152: v36.19,17.02 35.99,16.81 34.65,16.81 34.24,17.22 34.24,20.27 32.82,21.69 31.34,21.69 v30.86,22.17
N$2
  Top 0.152: U3.4 13.31,2.14 13.21,2.03 8.51,2.03 8.25,2.29 8.25,3.28 8.76,3.78 | U3.2 9.11,3.46 8.79,3.78 8.76,3.78 | R2.1 8.76,3.81 8.76,3.78
N$3
  Top 0.152: 22.02,3.43 22.05,3.43 U4.2 21.18,3.46 21.08,3.56 | U4.4 24.9,2.39 24.54,2.03 20.45,2.03 20.19,2.29 20.19,3.17 20.57,3.56 21.08,3.56 | R4.1 22.1,4.83 21.72,4.44 21.34,4.44 21.08,4.19 21.08,3.56
N$4
  Top 0.152: R6.1 16.13,4.7 15.88,4.44 15.62,4.44 | 15.62,4.44 14.86,4.44 14.61,4.19 14.61,2.39 14.96,2.03 18.67,2.03 19.18,2.54 U5.4 | U5.2 15.84,3.46 15.62,3.68 15.62,4.44
PA_1
  Top 0.152: LED1.C 55.38,2.88 R8.2
PA_3  (via drill 0.25)
  Top 0.152: v30.53,2.08 30.54,2.07 30.59,2.12 U1.A18 | v25.78,7.62 25.15,8.25 25.12,8.25 22.35,8.25 22.1,8 R4.2 R5.2
  Bottom 0.152: v30.53,2.08 30.53,2.84 26.31,7.06 25.78,7.59 v25.78,7.62
PA_11  (via drill 0.25)
  Top 0.152: v60.91,28.32 60.99,28.4 U8.6 | v48.67,9.91 52.12,9.91 v52.32,10.11 | U1.A10 32.21,11.66 v29.85,11.66
  Bottom 0.152: v29.85,11.66 32.89,11.66 34.85,9.7 48.46,9.7 v48.67,9.91 | v52.32,10.11 52.32,15.39 54.15,17.22 57,17.22 58.01,18.24 58.01,19.13 59.84,20.95 59.84,28.09 60.07,28.32 v60.91,28.32
PA_12  (via drill 0.25)
  Top 0.152: v30.58,9.3 30.61,9.27 32.22,9.27 U1.A12 | v60.32,28.91 61.54,28.91 61.59,28.96 61.69,29.05 U8.5
  Bottom 0.152: v30.58,9.3 49.48,9.3 50.9,10.72 50.9,11.53 50.09,12.34 50.09,15.6 52.12,17.63 56.79,17.63 57.61,18.44 57.61,19.3 59.44,21.13 59.44,28.63 59.71,28.91 v60.32,28.91
PC_2  (via drill 0.25)
  Top 0.152: R7.2 R6.2 16.13,9.4 16.26,9.52 17.45,10.72 18.19,10.72 22.25,10.72 23.06,11.53 v23.49,11.53 23.88,11.94 25.91,13.97 28.14,13.97 29.57,15.39 29.57,15.8 30.48,16.71 30.48,17.27 30.92,17.71 U1.A5
PD_8  (via drill 0.25)
  Top 0.152: v28.83,6.71 29.99,5.67 32.22,5.67 U1.A15 | U6.4 17.58,27.71 v17.6,27.69
  Bottom 0.152: v28.83,6.71 28.35,7.19 28.35,8.28 26.31,10.31 26.31,11.38 21.06,16.64 21.06,21.51 18.85,23.72 18.85,27.15 18.31,27.69 v17.6,27.69
PD_9  (via drill 0.25)
  Top 0.152: v27.53,7.67 27.81,7.39 29.23,7.39 29.77,6.86 32.24,6.86 32.24,6.89 U1.A14 | U6.3 17.77,27.06 v18.03,26.8
  Bottom 0.152: v27.53,7.67 27.53,8.48 25.91,10.11 25.91,11.18 25.88,11.2 25.83,11.25 20.68,16.41 20.68,21.31 18.49,23.49 18.49,26.29 18.03,26.75 v18.03,26.8
PD_11  (via drill 0.25)
  Top 0.152: v30.84,4.47 32.22,4.47 U1.A16 | U8.8 62.66,27.08 61.92,27.08 61.7,26.85 61.32,26.85 v60.83,26.37 | v56.59,10.11 59.64,10.11 v59.84,10.31
  Bottom 0.152: v56.59,10.11 53.95,10.11 50.9,7.06 42.98,7.06 42.37,7.67 32.41,7.67 30.79,6.04 30.79,4.52 v30.84,4.47 | v60.83,26.37 60.83,20.78 59.92,19.86 59.92,18.26 59.64,17.98 59.64,12.55 59.84,12.34 v59.84,10.31
PD_12  (via drill 0.25)
  Top 0.152: v61.29,27.46 61.58,27.75 U8.7 | v30.79,3.53 31,3.31 U1.A17
  Bottom 0.152: v30.79,3.53 30.2,4.11 30.2,4.77 30.38,4.95 30.38,6.25 32.21,8.08 42.57,8.08 43.18,7.47 50.7,7.47 52.93,9.7 52.93,15.19 54.56,16.81 57.2,16.81 58.42,18.03 58.42,18.95 60.25,20.78 60.25,27.48 60.4,27.63 60.96,27.63 61.14,27.46 v61.29,27.46
PE_9  (via drill 0.25)
  Top 0.152: v56.79,18.85 50.28,18.85 49.07,18.85 49.02,18.8 48.51,18.29 48.51,17.02 47.75,16.26 47.75,16 47.07,15.32 U1.C12 | v60.86,29.62 60.94,29.7 U8.4
  Bottom 0.152: v56.79,18.85 57,19.05 57,19.66 57.2,19.86 57.61,19.86 59.03,21.29 59.03,29.01 59.64,29.62 v60.86,29.62
PE_11  (via drill 0.25)
  Top 0.152: v27.74,12.34 27.33,12.34 24.69,9.7 v23.67,9.7 | v19,17.63 18.92,17.55 U7.4 | v44.22,13.97 45.34,13.97 45.49,14.12 U1.C11 47.65,14.12 48.13,14.6 48.13,16.13 48.26,16.26 48.28,16.28 U2.1
  Bottom 0.152: v44.22,13.97 44.02,14.17 33.43,14.17 31.39,12.14 30.18,12.14 29.77,12.55 27.94,12.55 v27.74,12.34 | v23.67,9.7 22.66,10.72 22.66,13.77 19.84,16.59 19.84,17.4 19.61,17.63 v19,17.63
PE_12  (via drill 0.25)
  Top 0.152: v43.59,8.28 43.79,8.48 43.79,10.11 44.4,10.72 44.81,10.72 45.41,10.72 45.47,10.67 45.66,10.47 46.67,10.47 U1.C8 47.04,10.52 47.85,11.33 47.85,11.73 v48.26,12.14 | v28.96,5.64 28.35,5.64 26.92,7.06 26.92,7.87 25.91,8.89 25.3,8.89 25.1,8.69 21.03,8.69 20.88,8.53 v19.56,8.53 | U7.6 14.93,18.85 v14.61,18.64 | v50.29,11.12 50.5,11.33 53.54,11.33 54.15,11.94 54.15,13.36 54.53,13.74 U2.6
  Bottom 0.152: v28.96,5.64 29.97,6.65 29.97,7.06 30.99,8.08 31.6,8.08 32,8.48 42.77,8.48 42.98,8.28 v43.59,8.28 | v14.61,18.64 17.42,15.82 18.08,15.82 21.06,12.85 21.06,11.81 20.27,11.02 19.46,11.02 19,10.57 19,9.09 v19.56,8.53 | v48.26,12.14 48.26,11.53 48.67,11.12 v50.29,11.12
PE_13  (via drill 0.25)
  Top 0.152: v29.46,9.45 29.41,9.5 25.3,9.5 24.89,9.09 20.07,9.09 v19.63,9.52 | U7.7 16.14,19.48 v14.76,19.48 | v48.79,15.06 48.87,14.99 50.61,14.99 U2.2 | U1.C6 46.77,8.07 v48.43,8.07 v48.44,8.08 48.39,8.28 48.39,8.89 47.88,9.4 47.88,10.29 49.28,11.68 v49.28,11.73
  Bottom 0.152: v48.44,8.08 45.21,8.08 44.37,8.91 31.47,8.91 31.19,8.64 30.28,8.64 v29.46,9.45 | v14.76,19.48 14.78,19.46 16.41,19.46 16.79,19.07 16.79,17.02 17.58,16.23 18.24,16.23 21.49,12.98 21.49,11.66 20.47,10.64 19.91,10.64 19.63,10.36 v19.63,9.52 | v49.28,11.73 49.28,12.55 49.68,12.95 49.68,14.17 v48.79,15.06
PE_14  (via drill 0.25)
  Top 0.152: v43.38,16.2 43.59,16 43.59,13.44 v43.76,13.26 45.35,13.26 45.47,13.14 45.69,12.92 U1.C10 | U7.8 v17.63,20.14 | v20.45,10.03 20.75,10.31 22.45,10.31 23.06,10.92 24.08,10.92 24.13,10.92 v26.57,13.36 | U2.5 55.3,12.47 53.75,10.92 51.11,10.92 50.7,10.52 v49.28,10.52
  Bottom 0.152: v43.38,16.2 42.37,16.2 41.96,15.8 31.37,15.8 31.17,16 30.58,16 29.97,15.39 29.97,14.58 28.75,13.36 v26.57,13.36 | v17.63,20.14 17.17,19.68 17.17,17.22 17.78,16.61 18.62,16.61 19.02,16.2 19.41,15.8 21.84,13.36 21.84,11.33 20.83,10.31 20.55,10.03 v20.45,10.03 | v49.28,10.52 48.67,10.52 47.85,11.33 47.42,11.33 45.61,13.14 44.82,13.14 44.81,13.16 43.87,13.16 v43.76,13.26
PF_0  (via drill 0.25)
  Top 0.152: v48.46,22.48 v48.46,22.47 48.41,22.52 U1.C18 | U6.1 20.73,25.76 20.93,25.55 v21.56,25.55
  Bottom 0.152: v48.46,22.48 34.27,22.48 32.61,24.13 26.34,24.13 25.93,23.72 23.77,23.72 22.63,23.72 21.59,24.76 21.56,24.79 v21.56,25.55
PF_1  (via drill 0.25)  (1 unrouted)
  Top 0.152: 46.43,21.29 46.69,21.29 v48.46,21.29 | U7.9 16.17,20.78 17.88,20.78 v22.45,25.35
  Bottom 0.152: v22.45,25.35 22.45,25.15 23.47,24.13 25.73,24.13 26.14,24.54 32.82,24.54 34.44,22.91 47.65,22.91 47.85,23.11 48.67,23.11 49.07,22.71 49.07,21.89 v48.46,21.29
PF_6  (via drill 0.25)
  Top 0.152: v43.79,18.03 44.4,17.42 44.4,17.02 44.82,16.6 44.9,16.52 U1.C13 | v25.1,14.71 25.1,13.77 23.47,12.14 23.06,12.14 22.05,11.12 18.59,11.12 11.51,11.12 11.28,10.9 8.76,8.38 R2.2 R3.2
  Bottom 0.152: v43.79,18.03 43.59,18.03 41.76,16.2 31.57,16.2 31.37,16.41 30.38,16.41 29.57,15.6 29.57,14.78 28.8,14.02 26.59,14.02 26.04,14.71 v25.1,14.71
PG_4  (via drill 0.25)
  Top 0.152: v51.92,6.86 46.72,6.86 U1.C5 | v54.97,9.3 v58.83,9.3 | v58.83,17.02 59.03,17.22 60.05,17.22 60.25,17.02 v62.97,17.02 | v61.87,24.54 61.27,25.15 61.27,25.96 61.75,26.45 U8.9 | U1.C5
  Bottom 0.152: v51.92,6.86 52.12,7.06 52.12,7.67 53.75,9.3 v54.97,9.3 | v58.83,9.3 v58.83,17.02 | v62.97,17.02 62.89,17.22 62.89,18.44 62.08,19.25 62.08,20.27 61.27,21.08 61.27,24.13 61.67,24.54 v61.87,24.54
SW0  (via drill 0.25)
  Top 0.152: v21.64,9.7 22.45,9.7 23.27,10.52 24.28,10.52 24.89,11.12 25.5,11.12 26.72,12.34 27.25,12.88 27.33,12.95 27.64,12.95 28.96,12.95 29.97,13.97 29.97,15.39 31.05,16.47 31.1,16.52 U1.A6 | v17.78,18.24 17.74,18.2 U7.5
  Bottom 0.152: v21.64,9.7 22.25,10.31 22.25,13.56 19.81,16 19.05,16.81 18.85,17.02 18.16,17.02 17.78,17.4 v17.78,18.24
TGT_NRESET  (via drill 0.25)
  Top 0.152: U6.7 18.98,29.66 v19.07,29.57 | U1.A1 32.26,22.5 32.23,22.5 32.23,23.02 31.75,23.49 28.57,23.49 28.08,23 R1.1 | v26.9,22.5 27.2,22.2 R1.1 | 28.32,22.21 R1.1
  Bottom 0.152: v26.9,22.5 21.84,22.5 20.07,24.28 20.07,28.78 19.28,29.57 v19.07,29.57
TGT_RX  (via drill 0.25)
  Top 0.152: v29.16,8.08 32.26,8.08 | 32.61,8.08 32.26,8.08 | v18.54,28.4 16.2,28.4 U6.5 | 32.26,8.08 U1.A13
  Bottom 0.152: v29.16,8.08 26.92,10.31 26.92,11.33 21.44,16.81 21.44,21.69 19.2,23.93 19.2,27.89 18.69,28.4 v18.54,28.4
TGT_SWCLK  (via drill 0.25)
  Top 0.152: v35.25,19.86 33.86,19.86 33.86,19.92 U1.TP9 | U6.8 18.08,30.31 v17.96,30.3
  Bottom 0.152: v35.25,19.86 31.8,23.32 26.82,23.32 26.42,22.91 22.05,22.91 20.45,24.51 20.45,29.23 19.38,30.3 v17.96,30.3
TGT_SWDIO  (via drill 0.25)
  Top 0.152: v34.98,17.42 34.95,17.4 34.91,17.45 U1.TP7 | v17.45,31.04 16.24,31.04 U6.9
  Bottom 0.152: v34.98,17.42 35.66,17.42 35.86,17.63 35.86,20.27 32.41,23.72 26.54,23.72 26.14,23.32 22.25,23.32 20.83,24.74 20.83,29.57 19.36,31.04 v17.45,31.04
TGT_TX  (via drill 0.25)
  Top 0.152: v27.74,10.72 32.21,10.72 32.41,10.52 32.3,10.52 U1.A11 | U6.6 17.6,29.01 v17.73,29.01
  Bottom 0.152: v17.73,29.01 18.8,29.01 19.61,28.19 19.61,24.13 21.84,21.89 21.84,17.02 27.74,11.12 v27.74,10.72

### Text on the board
tPlace: GND / 3V3 / / TGT_SWDIO / TGT_SWCLK / TGT_NRESET / TGT_TX / TGT_RX / PD_8 / PD_9 / PF_0 / PF_1 / PE_14 / PE_13 / PE_12 / SW0 / PE_11 / PF_6 / PA_3 / PC_2 | GND / / / / PE_9 / PA_12 / PA_11 / PD_12 / / / / / / / / PD_11 / PG_4 / LED_GREEN / LED_BLUE / LED_RED | Module Carrier Board / U-Blox: Odin W2 / v2.0.0